# EAGLE schematic 2 (EAGLE 6.4)
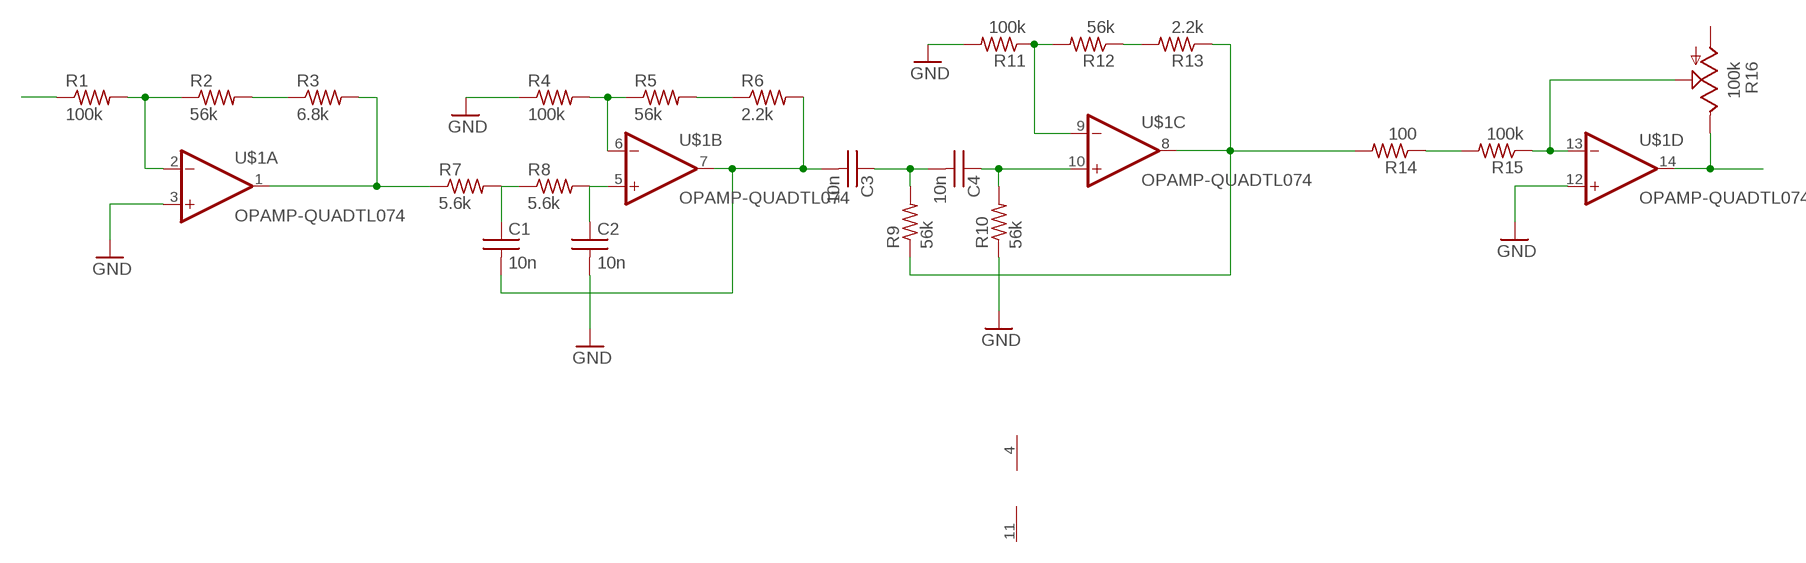
[diagram p0: schematic, sheet 1]

## Parts
C1  10n  CAPACITOR  [BOX-2.5MM-7.2MM]
C2  10n  CAPACITOR  [BOX-2.5MM-7.2MM]
C3  10n  CAPACITOR  [BOX-2.5MM-7.2MM]
C4  10n  CAPACITOR  [BOX-2.5MM-7.2MM]
R1  100k  RESISTOR0.25W-0.4IN-CARBONFILM  [0.25W-0.4IN-CARBONFILM]
R2  56k  RESISTOR0.25W-0.4IN-CARBONFILM  [0.25W-0.4IN-CARBONFILM]
R3  6.8k  RESISTOR0.25W-0.4IN-CARBONFILM  [0.25W-0.4IN-CARBONFILM]
R4  100k  RESISTOR0.25W-0.4IN-CARBONFILM  [0.25W-0.4IN-CARBONFILM]
R5  56k  RESISTOR0.25W-0.4IN-CARBONFILM  [0.25W-0.4IN-CARBONFILM]
R6  2.2k  RESISTOR0.25W-0.4IN-CARBONFILM  [0.25W-0.4IN-CARBONFILM]
R7  5.6k  RESISTOR0.25W-0.4IN-CARBONFILM  [0.25W-0.4IN-CARBONFILM]
R8  5.6k  RESISTOR0.25W-0.4IN-CARBONFILM  [0.25W-0.4IN-CARBONFILM]
R9  56k  RESISTOR0.25W-0.4IN-CARBONFILM  [0.25W-0.4IN-CARBONFILM]
R10  56k  RESISTOR0.25W-0.4IN-CARBONFILM  [0.25W-0.4IN-CARBONFILM]
R11  100k  RESISTOR0.25W-0.4IN-CARBONFILM  [0.25W-0.4IN-CARBONFILM]
R12  56k  RESISTOR0.25W-0.4IN-CARBONFILM  [0.25W-0.4IN-CARBONFILM]
R13  2.2k  RESISTOR0.25W-0.4IN-CARBONFILM  [0.25W-0.4IN-CARBONFILM]
R14  100  RESISTOR0.25W-0.4IN-CARBONFILM  [0.25W-0.4IN-CARBONFILM]
R15  100k  RESISTOR0.25W-0.4IN-CARBONFILM  [0.25W-0.4IN-CARBONFILM]
R16  100k  POTENTIOMETERHORIZONTAL  [POT-SIDE-16MM-BITECH-P160KN]
U$1  OPAMP-QUADTL074  [DIP14]

## Nets
0: C2.P$2 R4.1 R10.1 R11.2 U$1.3(A:IN+) U$1.12(D:IN+)
N$1: R1.2 R2.1 U$1.2(A:IN-)
N$2: R2.2 R3.1
N$3: R3.2 R7.1 U$1.1(A:OUT)
N$4: C1.P$1 R7.2 R8.1
N$5: C2.P$1 R8.2 U$1.5(B:IN+)
N$6: R4.2 R5.1 U$1.6(B:IN-)
N$7: R5.2 R6.1
N$8: R16.P$3 U$1.14(D:OUT)
N$9: C3.P$1 C4.P$2 R9.2
N$11: R11.1 R12.2 U$1.9(C:IN-)
N$12: R12.1 R13.2
N$13: R1.1
N$14: C4.P$1 R10.2 U$1.10(C:IN+)
N$16: R14.1 R15.2
N$17: R15.1 R16.P$2 U$1.13(D:IN-)
N$18: C1.P$2 C3.P$2 R6.2 U$1.7(B:OUT)
N$19: R9.1 R13.1 R14.2 U$1.8(C:OUT)
Unconnected: R16.P$1

## Power pins joined to a net without a drawn wire
VCC: U$1.4(SUP:VCC)
VEE: U$1.11(SUP:VEE)

## Library data of the parts
C1-C4 = Capacitors:CAPACITOR: Capacitor; SPICE: C{NAME} {1.NET} {2.NET} {VALUE}
R1-R15 = Resistors:RESISTOR: Resistor; SPICE: R{NAME} {1.NET} {2.NET} {VALUE}
R16 = Potentiometers:POTENTIOMETER: Potentiometer; PERCENT: 50; SPICE: R{NAME}CW {3.NET} {2.NET} {{{VALUE} - {{{ATTR.PERCENT} / 100} * {VALUE}}} + 0.001}\nR{NAME}CCW {2.NET} {1.NET} {{{{ATTR.PERCENT} / 100} * {VALUE}} + 0.001}
U$1 = Op Amps:OPAMP-QUAD: Operational amplifier, quad; SPICE: X{NAME}A {A.IN+.NET} {A.IN-.NET} {VCC.NET} {VEE.NET} {A.OUT.NET} TL074\nX{NAME}B {B.IN+.NET} {B.IN-.NET} {VCC.NET} {VEE.NET} {B.OUT.NET} TL074\nX{NAME}C {C.IN+.NET} {C.IN-.NET} {VCC.NET} {VEE.NET} {C.OUT.NET} TL074\nX{NAME}D {D.IN+.NET} {D.IN-.NET} {VCC.NET} {VEE.NET} {D.OUT.NET} TL074; SPICEMOD: .SUBCKT TL074 1 2 3 4 5\nC1 11 12 3.498E-12\nC2 6 7 15.00E-12\nDC 5 53 DX\nDE 54 5 DX\nDLP 90 91 DX\nDLN 92 90 DX\nDP 4 3 DX\nEGND 99 0 POLY(2) (3,0) (4,0) 0 .5 .5\nFB 7 99 POLY(5) VB VC VE VLP VLN 0 4.715E6 -5E6 5E6 5E6 -5E6\nGA 6 0 11 12 282.8E-6\nGCM 0 6 10 99 8.942E-9\nISS 3 10 DC 195.0E-6\nHLIM 90 0 VLIM 1K\nJ1 11 2 10 JX\nJ2 12 1 10 JX\nR2 6 9 100.0E3\nRD1 4 11 3.536E3\nRD2 4 12 3.536E3\nRO1 8 5 150\nRO2 7 99 150\nRP 3 4 2.143E3\nRSS 10 99 1.026E6\nVB 9 0 DC 0\nVC 3 53 DC 2.200\nVE 54 4 DC 2.200\nVLIM 7 8 DC 0\nVLP 91 0 DC 25\nVLN 0 92 DC 25\n.MODEL DX D(IS=800.0E-18)\n.MODEL JX PJF(IS=15.00E-12 BETA=270.1E-6 VTO=-1)\n.ENDS

## Net classes
0 default: width 1.27 mm, drill 1.27 mm, clearance 0.254 mm